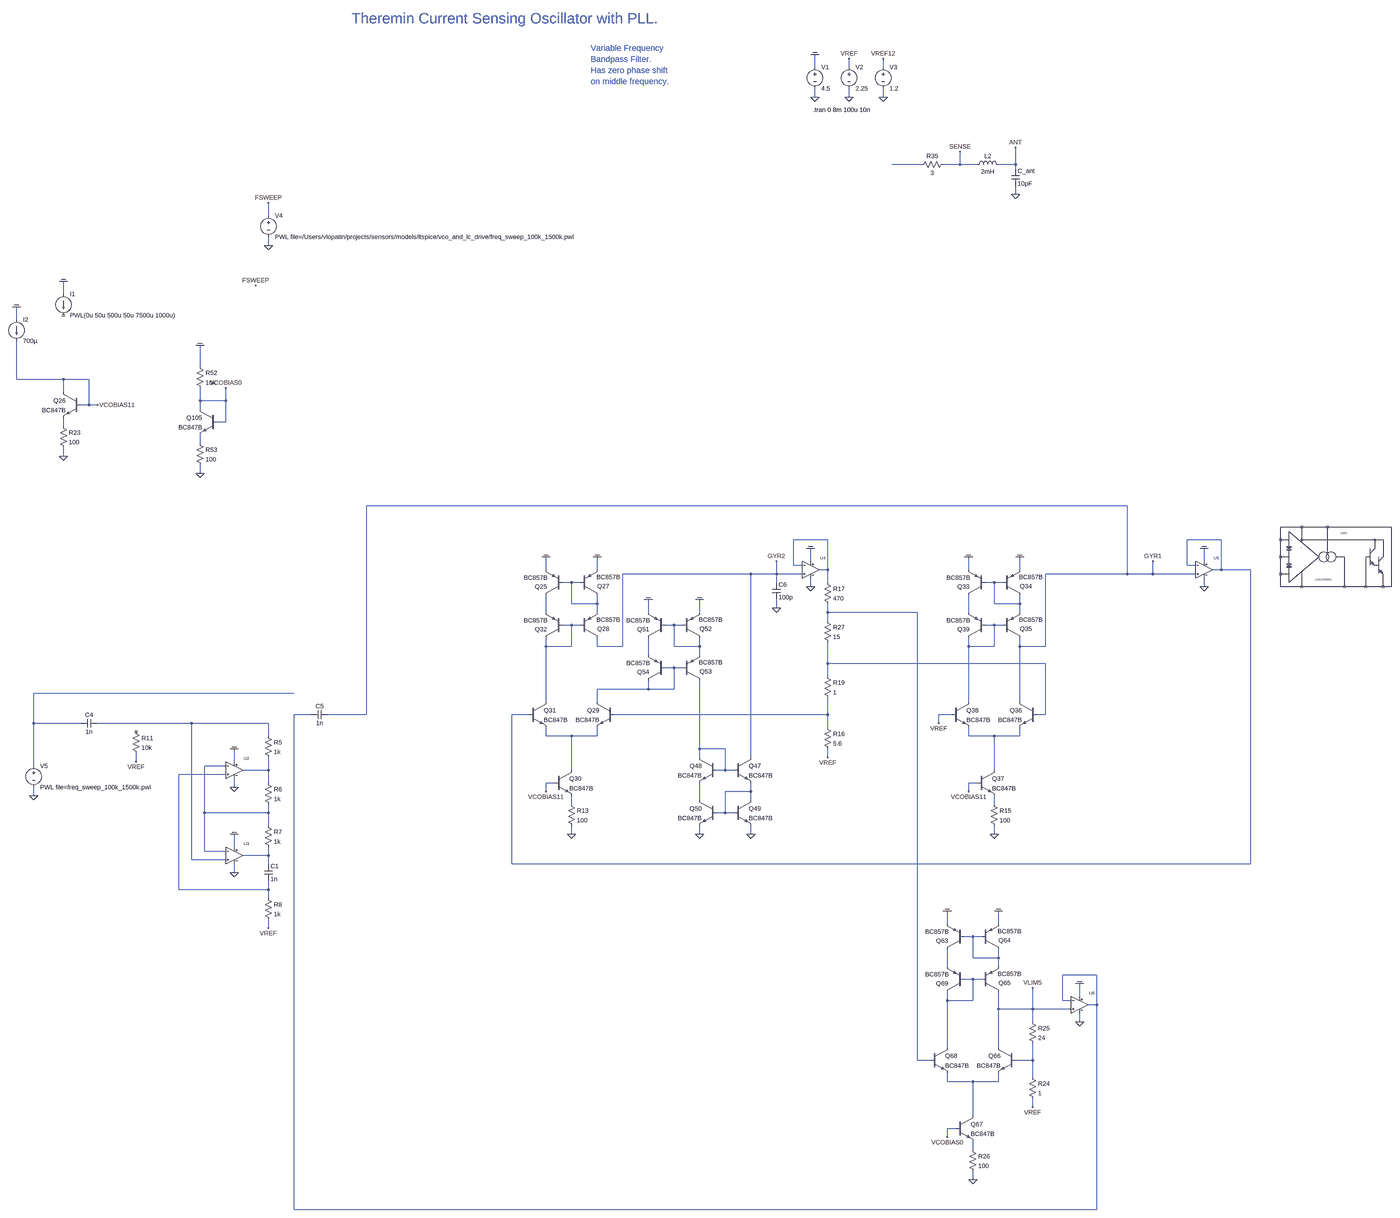
[diagram p0: schematic vco_and_lc_drive_v09_utf8.asc, whole sheet]
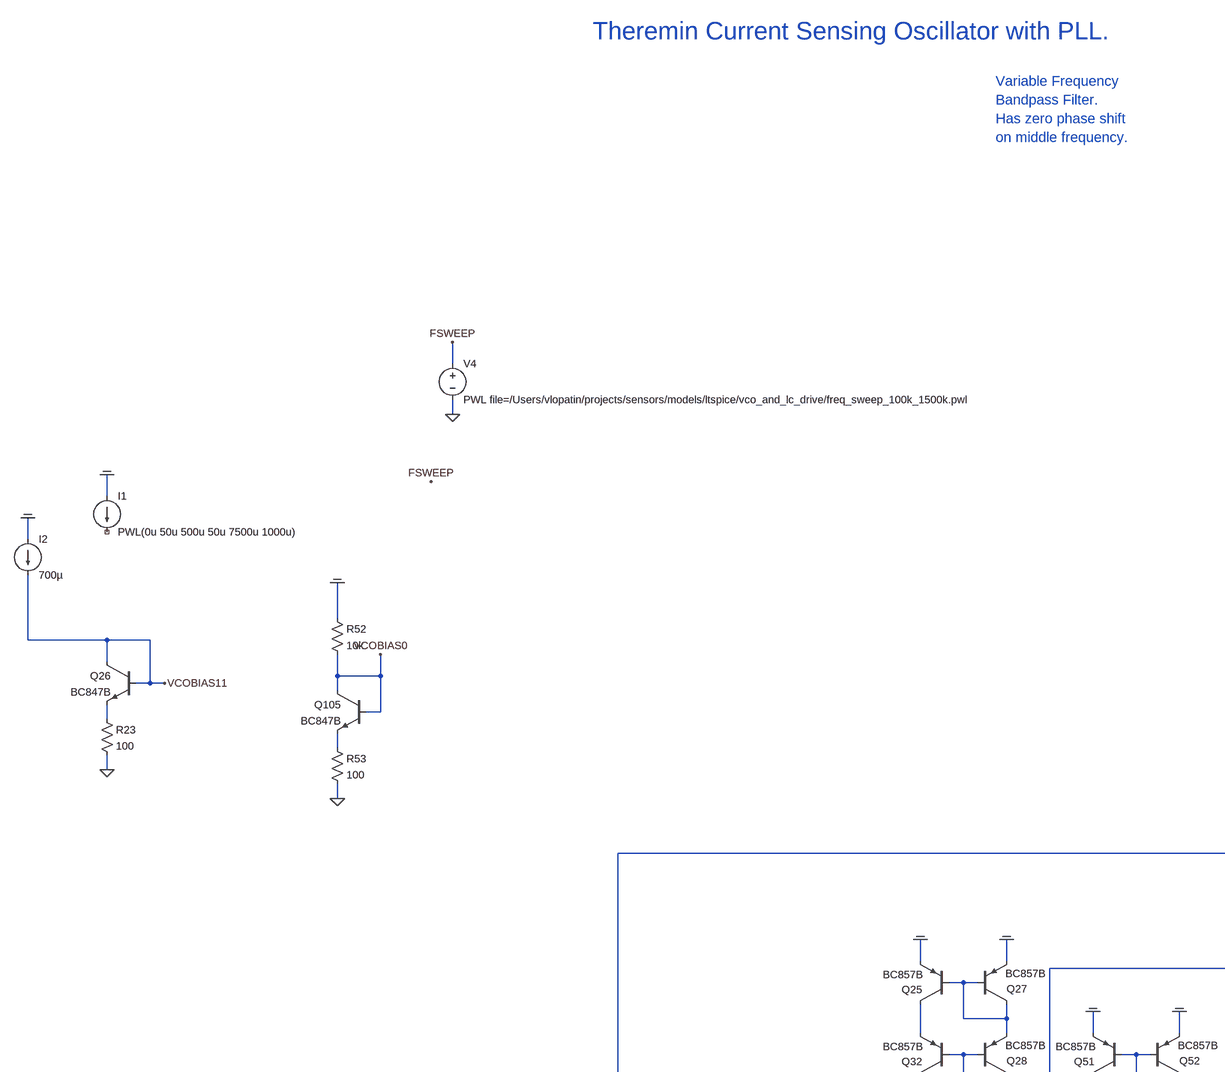
[diagram p1: schematic vco_and_lc_drive_v09_utf8.asc, part, row 1 of 2, column 1 of 2]
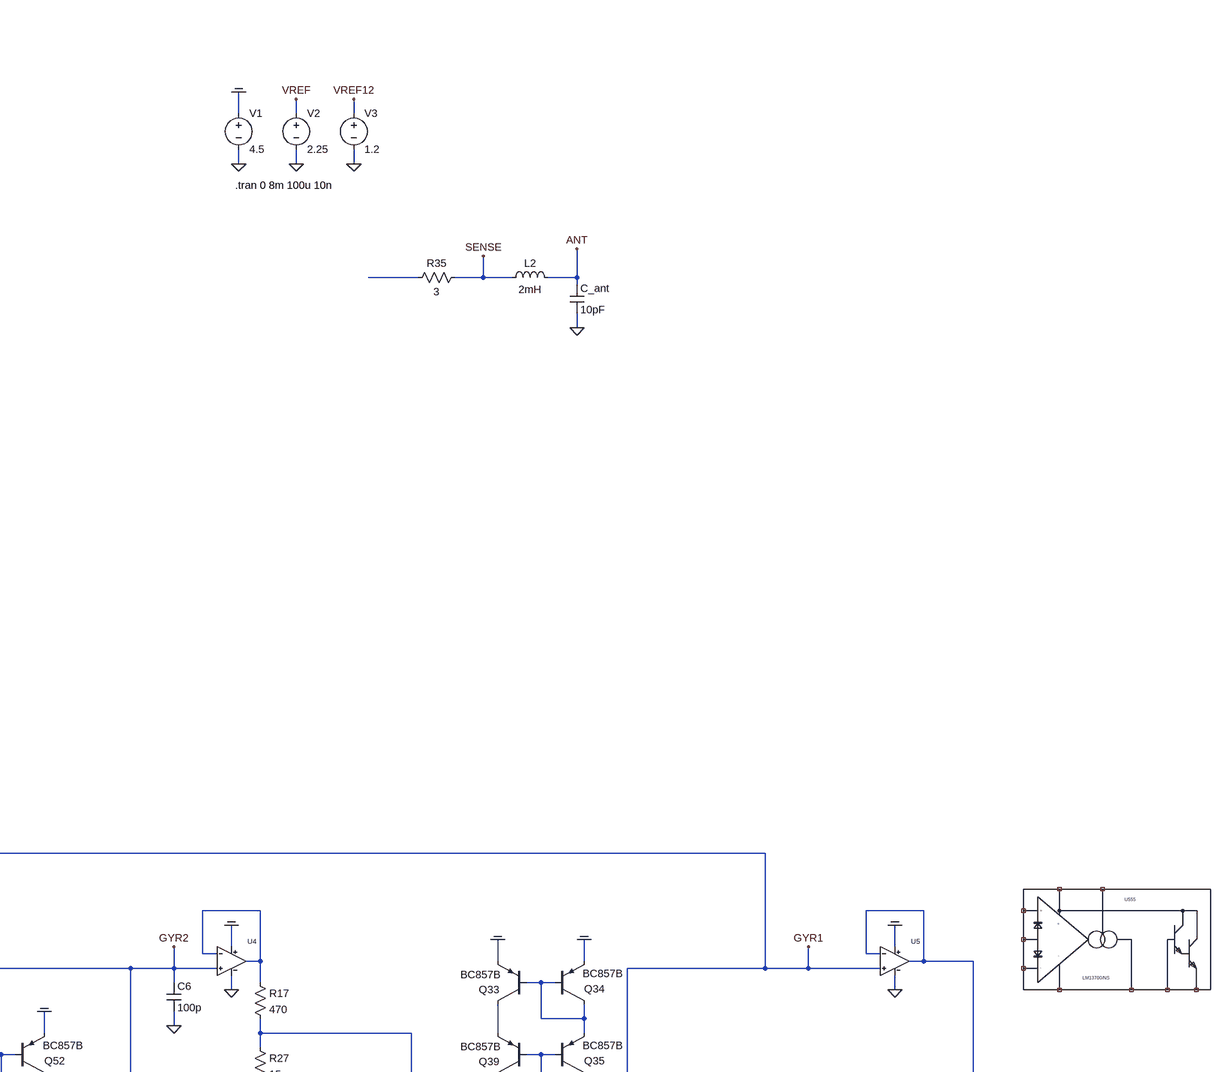
[diagram p2: schematic vco_and_lc_drive_v09_utf8.asc, part, row 1 of 2, column 2 of 2]
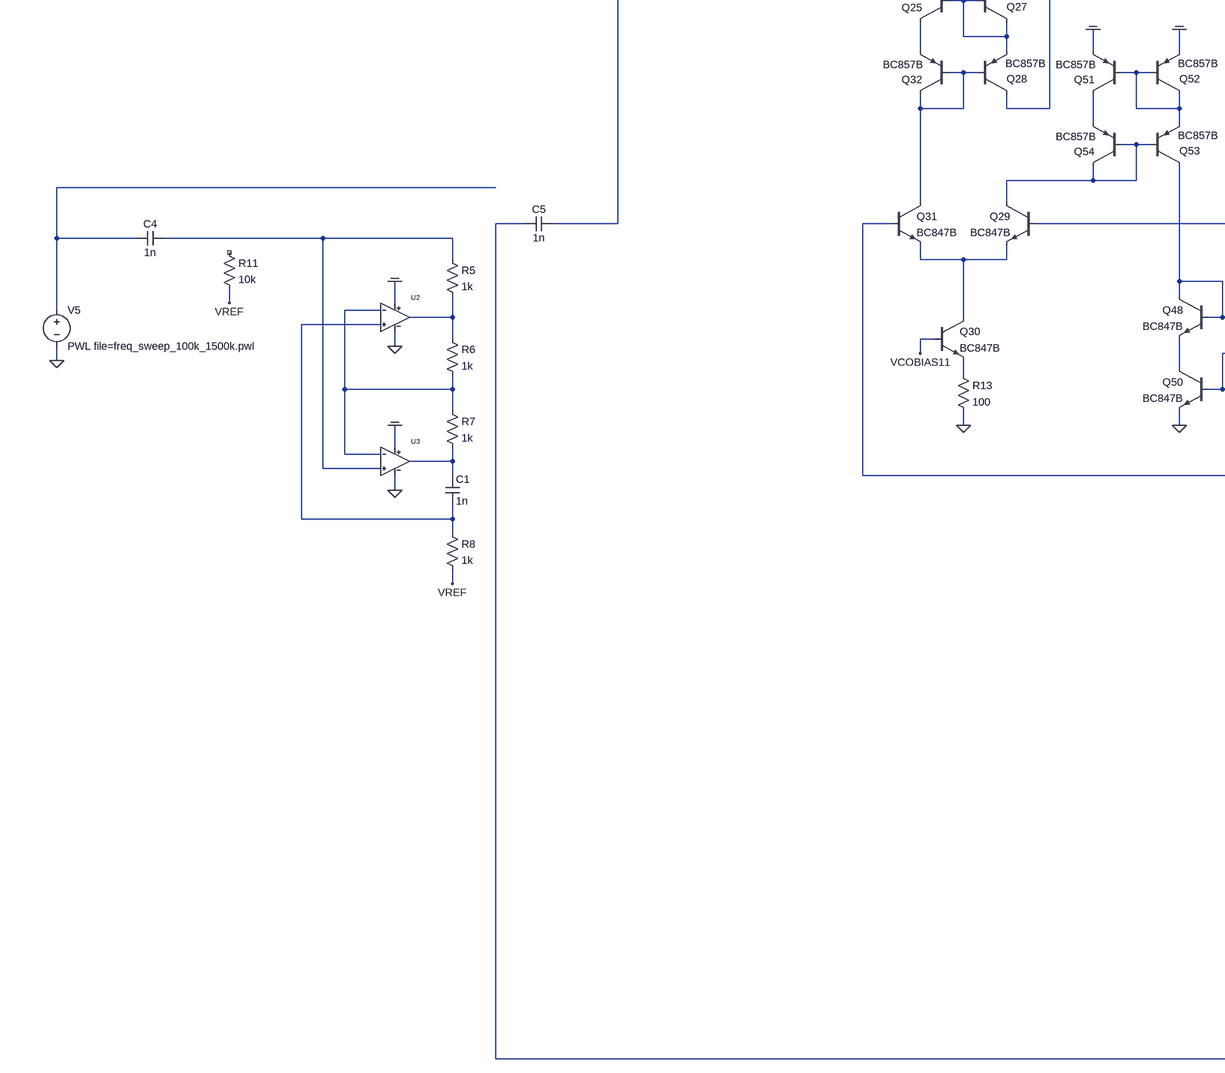
[diagram p3: schematic vco_and_lc_drive_v09_utf8.asc, part, row 2 of 2, column 1 of 2]
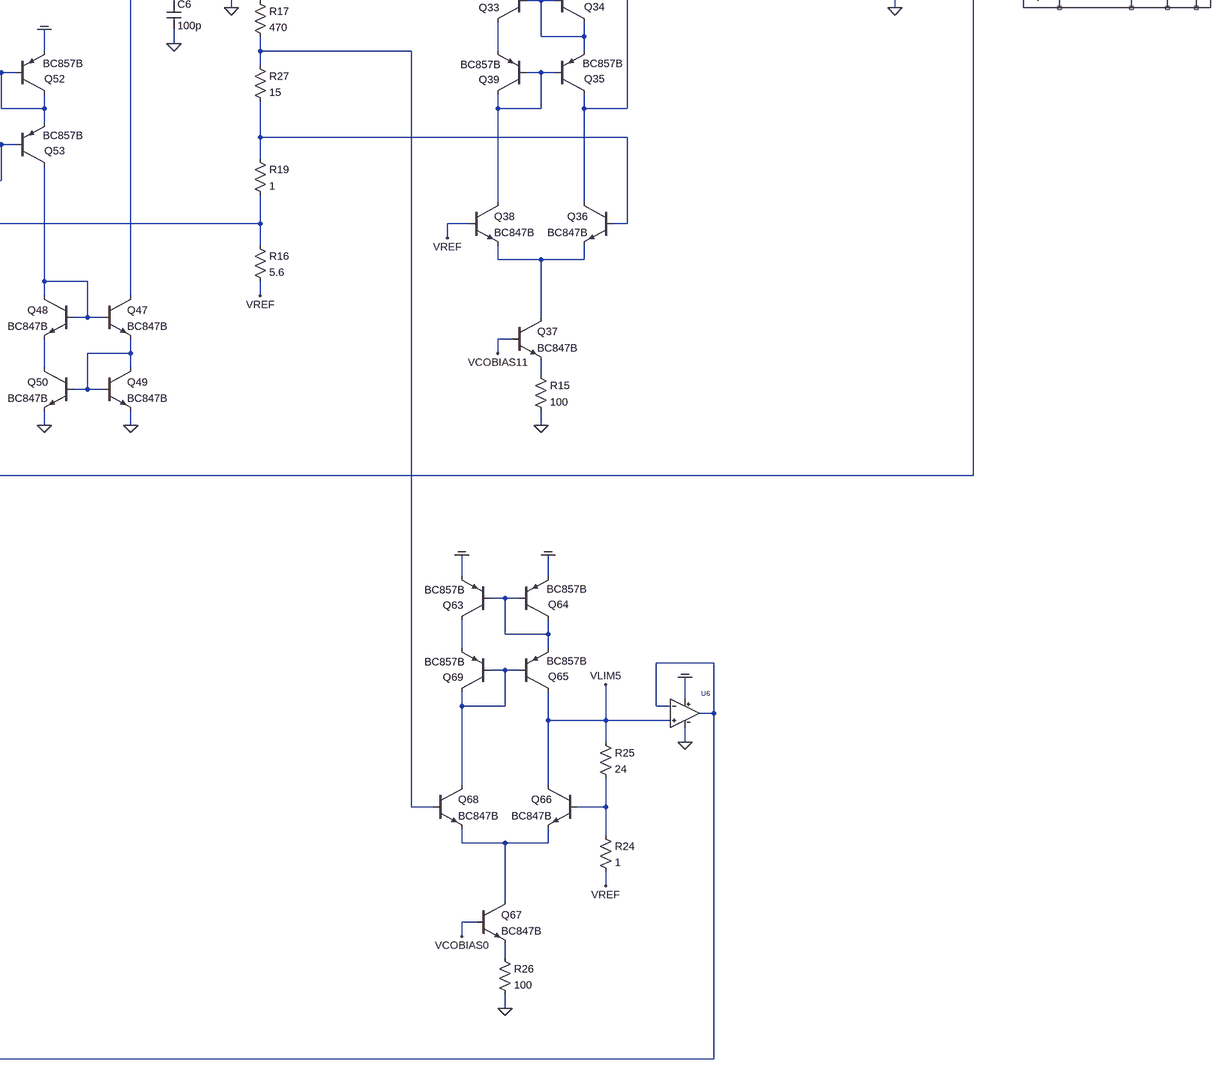
[diagram p4: schematic vco_and_lc_drive_v09_utf8.asc, part, row 2 of 2, column 2 of 2]
vco_and_lc_drive_v09_utf8.asc, the LTspice schematic file:
Version 4
SHEET 1 13504 24832
WIRE -5600 19072 -5600 19024
WIRE -5472 19072 -5472 19040
WIRE -5344 19072 -5344 19040
WIRE -5600 19184 -5600 19152
WIRE -5472 19184 -5472 19152
WIRE -5344 19184 -5344 19152
WIRE -5200 19440 -5312 19440
WIRE -5056 19440 -5056 19392
WIRE -5056 19440 -5120 19440
WIRE -4992 19440 -5056 19440
WIRE -4848 19440 -4848 19376
WIRE -4848 19440 -4912 19440
WIRE -4848 19456 -4848 19440
WIRE -4848 19552 -4848 19520
WIRE -7648 19632 -7648 19584
WIRE -7648 19744 -7648 19712
WIRE -8416 20656 -8416 20608
WIRE -8592 20752 -8592 20704
WIRE -7904 20928 -7904 20848
WIRE -8592 20976 -8592 20832
WIRE -8416 20976 -8592 20976
WIRE -8320 20976 -8416 20976
WIRE -8416 21024 -8416 20976
WIRE -7904 21056 -7904 21008
WIRE -7808 21056 -7808 21008
WIRE -7808 21056 -7904 21056
WIRE -8320 21072 -8320 20976
WIRE -8320 21072 -8352 21072
WIRE -8288 21072 -8320 21072
WIRE -7904 21088 -7904 21056
WIRE -7808 21136 -7808 21056
WIRE -7808 21136 -7840 21136
WIRE -8416 21152 -8416 21120
WIRE -7904 21216 -7904 21184
WIRE -8416 21264 -8416 21232
WIRE -7904 21328 -7904 21296
WIRE -4256 21568 -7280 21568
WIRE -5552 21696 -5680 21696
WIRE -3904 21696 -4032 21696
WIRE -5616 21776 -5616 21728
WIRE -3968 21776 -3968 21728
WIRE -5680 21792 -5680 21696
WIRE -5648 21792 -5680 21792
WIRE -4032 21792 -4032 21696
WIRE -4000 21792 -4032 21792
WIRE -6608 21808 -6608 21760
WIRE -6416 21808 -6416 21760
WIRE -5552 21808 -5552 21696
WIRE -5552 21808 -5584 21808
WIRE -5024 21808 -5024 21760
WIRE -4832 21808 -4832 21760
WIRE -3904 21808 -3904 21696
WIRE -3904 21808 -3936 21808
WIRE -3760 21808 -3904 21808
WIRE -5840 21824 -6320 21824
WIRE -5744 21824 -5744 21776
WIRE -5744 21824 -5840 21824
WIRE -5648 21824 -5744 21824
WIRE -4256 21824 -4256 21568
WIRE -4256 21824 -4736 21824
WIRE -4160 21824 -4160 21776
WIRE -4160 21824 -4256 21824
WIRE -4000 21824 -4160 21824
WIRE -6512 21856 -6544 21856
WIRE -6480 21856 -6512 21856
WIRE -5744 21856 -5744 21824
WIRE -5552 21856 -5552 21808
WIRE -4928 21856 -4960 21856
WIRE -4896 21856 -4928 21856
WIRE -5616 21872 -5616 21840
WIRE -3968 21872 -3968 21840
WIRE -6512 21936 -6512 21856
WIRE -6416 21936 -6416 21904
WIRE -6416 21936 -6512 21936
WIRE -4928 21936 -4928 21856
WIRE -4832 21936 -4832 21904
WIRE -4832 21936 -4928 21936
WIRE -5744 21952 -5744 21920
WIRE -6608 21968 -6608 21904
WIRE -6416 21968 -6416 21936
WIRE -6224 21968 -6224 21920
WIRE -6032 21968 -6032 21920
WIRE -5552 21968 -5552 21936
WIRE -5216 21968 -5552 21968
WIRE -5024 21968 -5024 21904
WIRE -4832 21968 -4832 21936
WIRE -5552 22000 -5552 21968
WIRE -6512 22016 -6544 22016
WIRE -6480 22016 -6512 22016
WIRE -6128 22016 -6160 22016
WIRE -6096 22016 -6128 22016
WIRE -4928 22016 -4960 22016
WIRE -4896 22016 -4928 22016
WIRE -6608 22096 -6608 22064
WIRE -6512 22096 -6512 22016
WIRE -6512 22096 -6608 22096
WIRE -6416 22096 -6416 22064
WIRE -6320 22096 -6320 21824
WIRE -6320 22096 -6416 22096
WIRE -6128 22096 -6128 22016
WIRE -6032 22096 -6032 22064
WIRE -6032 22096 -6128 22096
WIRE -5024 22096 -5024 22064
WIRE -4928 22096 -4928 22016
WIRE -4928 22096 -5024 22096
WIRE -4832 22096 -4832 22064
WIRE -4736 22096 -4736 21824
WIRE -4736 22096 -4832 22096
WIRE -6224 22128 -6224 22064
WIRE -6032 22128 -6032 22096
WIRE -5552 22160 -5552 22080
WIRE -4736 22160 -5552 22160
WIRE -6128 22176 -6160 22176
WIRE -6096 22176 -6128 22176
WIRE -5552 22208 -5552 22160
WIRE -6224 22256 -6224 22224
WIRE -6224 22256 -6416 22256
WIRE -6128 22256 -6128 22176
WIRE -6128 22256 -6224 22256
WIRE -7552 22272 -8528 22272
WIRE -6608 22304 -6608 22096
WIRE -6416 22304 -6416 22256
WIRE -5024 22304 -5024 22096
WIRE -4832 22304 -4832 22096
WIRE -7488 22352 -7552 22352
WIRE -7280 22352 -7280 21568
WIRE -7280 22352 -7424 22352
WIRE -6672 22352 -6736 22352
WIRE -5552 22352 -5552 22288
WIRE -5552 22352 -6352 22352
WIRE -5088 22352 -5136 22352
WIRE -4736 22352 -4736 22160
WIRE -4736 22352 -4768 22352
WIRE -8528 22384 -8528 22272
WIRE -8352 22384 -8528 22384
WIRE -7936 22384 -8288 22384
WIRE -7648 22384 -7936 22384
WIRE -5136 22384 -5136 22352
WIRE -5552 22400 -5552 22352
WIRE -7648 22432 -7648 22384
WIRE -6608 22432 -6608 22400
WIRE -6512 22432 -6608 22432
WIRE -6416 22432 -6416 22400
WIRE -6416 22432 -6512 22432
WIRE -5024 22432 -5024 22400
WIRE -4928 22432 -5024 22432
WIRE -4832 22432 -4832 22400
WIRE -4832 22432 -4928 22432
WIRE -6032 22480 -6032 22224
WIRE -5936 22480 -6032 22480
WIRE -6032 22512 -6032 22480
WIRE -5840 22512 -5840 21824
WIRE -5552 22512 -5552 22480
WIRE -8144 22528 -8144 22496
WIRE -7776 22528 -7776 22480
WIRE -8528 22544 -8528 22384
WIRE -7808 22544 -7888 22544
WIRE -7648 22560 -7648 22512
WIRE -7648 22560 -7744 22560
WIRE -6512 22560 -6512 22432
WIRE -5936 22560 -5936 22480
WIRE -5936 22560 -5968 22560
WIRE -5904 22560 -5936 22560
WIRE -4928 22560 -4928 22432
WIRE -7808 22576 -7984 22576
WIRE -7648 22608 -7648 22560
WIRE -6576 22608 -6608 22608
WIRE -4992 22608 -5024 22608
WIRE -7776 22624 -7776 22592
WIRE -6608 22640 -6608 22608
WIRE -5840 22640 -5840 22608
WIRE -5840 22640 -5936 22640
WIRE -5024 22640 -5024 22608
WIRE -8528 22656 -8528 22624
WIRE -6032 22672 -6032 22608
WIRE -5840 22672 -5840 22640
WIRE -6512 22688 -6512 22656
WIRE -4928 22688 -4928 22656
WIRE -7888 22720 -7888 22544
WIRE -7648 22720 -7648 22688
WIRE -7648 22720 -7888 22720
WIRE -5936 22720 -5936 22640
WIRE -5936 22720 -5968 22720
WIRE -5904 22720 -5936 22720
WIRE -7648 22768 -7648 22720
WIRE -6512 22800 -6512 22768
WIRE -6032 22800 -6032 22768
WIRE -5840 22800 -5840 22768
WIRE -4928 22800 -4928 22768
WIRE -7776 22848 -7776 22800
WIRE -7888 22864 -7888 22720
WIRE -7808 22864 -7888 22864
WIRE -7648 22880 -7648 22848
WIRE -7648 22880 -7744 22880
WIRE -7936 22896 -7936 22384
WIRE -7808 22896 -7936 22896
WIRE -7648 22912 -7648 22880
WIRE -6736 22912 -6736 22352
WIRE -3760 22912 -3760 21808
WIRE -3760 22912 -6736 22912
WIRE -7776 22944 -7776 22912
WIRE -7984 23008 -7984 22576
WIRE -7648 23008 -7648 22976
WIRE -7648 23008 -7984 23008
WIRE -7648 23040 -7648 23008
WIRE -5104 23136 -5104 23088
WIRE -4912 23136 -4912 23088
WIRE -7648 23152 -7648 23120
WIRE -5008 23184 -5040 23184
WIRE -4976 23184 -5008 23184
WIRE -5008 23264 -5008 23184
WIRE -4912 23264 -4912 23232
WIRE -4912 23264 -5008 23264
WIRE -5104 23296 -5104 23232
WIRE -4912 23296 -4912 23264
WIRE -4544 23328 -4672 23328
WIRE -5008 23344 -5040 23344
WIRE -4976 23344 -5008 23344
WIRE -4608 23408 -4608 23360
WIRE -5104 23424 -5104 23392
WIRE -5008 23424 -5008 23344
WIRE -5008 23424 -5104 23424
WIRE -4672 23424 -4672 23328
WIRE -4640 23424 -4672 23424
WIRE -4544 23440 -4544 23328
WIRE -4544 23440 -4576 23440
WIRE -4912 23456 -4912 23392
WIRE -4784 23456 -4784 23376
WIRE -4784 23456 -4912 23456
WIRE -4640 23456 -4784 23456
WIRE -4784 23504 -4784 23456
WIRE -4608 23504 -4608 23472
WIRE -5104 23600 -5104 23424
WIRE -4912 23600 -4912 23456
WIRE -5216 23648 -5216 21968
WIRE -5168 23648 -5216 23648
WIRE -4784 23648 -4784 23584
WIRE -4784 23648 -4848 23648
WIRE -4784 23712 -4784 23648
WIRE -5104 23728 -5104 23696
WIRE -5008 23728 -5104 23728
WIRE -4912 23728 -4912 23696
WIRE -4912 23728 -5008 23728
WIRE -4784 23824 -4784 23792
WIRE -5008 23856 -5008 23728
WIRE -5072 23904 -5104 23904
WIRE -5104 23936 -5104 23904
WIRE -5008 23984 -5008 23952
WIRE -5008 24096 -5008 24064
WIRE -7552 24208 -7552 22352
WIRE -4544 24208 -4544 23440
WIRE -4544 24208 -7552 24208
FLAG -5600 19184 0
FLAG -5600 19024 COM
FLAG -5472 19184 0
FLAG -5472 19040 VREF
FLAG -4848 19552 0
FLAG -4848 19376 ANT
FLAG -5056 19392 SENSE
FLAG -5344 19184 0
FLAG -5344 19040 VREF12
FLAG -8416 20608 COM
FLAG -8288 21072 VCOBIAS11
FLAG -8416 21264 0
FLAG -7904 20848 COM
FLAG -7904 21328 0
FLAG -7808 21008 VCOBIAS0
FLAG -7648 19744 0
FLAG -7648 19584 FSWEEP
FLAG -8592 20704 COM
FLAG -7696 20624 FSWEEP
FLAG -7776 22624 0
FLAG -7776 22480 COM
FLAG -7776 22944 0
FLAG -7776 22800 COM
FLAG -8528 22656 0
FLAG -7648 23152 VREF
FLAG -8144 22528 VREF
FLAG -6608 21760 COM
FLAG -6416 21760 COM
FLAG -6608 22640 VCOBIAS11
FLAG -6512 22800 0
FLAG -5744 21776 GYR2
FLAG -5744 21952 0
FLAG -4160 21776 GYR1
FLAG -5616 21872 0
FLAG -5616 21728 COM
FLAG -5552 22512 VREF
FLAG -6032 22800 0
FLAG -5840 22800 0
FLAG -6224 21920 COM
FLAG -6032 21920 COM
FLAG -5024 21760 COM
FLAG -4832 21760 COM
FLAG -5024 22640 VCOBIAS11
FLAG -4928 22800 0
FLAG -3968 21872 0
FLAG -3968 21728 COM
FLAG -5136 22384 VREF
FLAG -5104 23088 COM
FLAG -4912 23088 COM
FLAG -4784 23824 VREF
FLAG -4784 23376 VLIM5
FLAG -5104 23936 VCOBIAS0
FLAG -5008 24096 0
FLAG -4608 23504 0
FLAG -4608 23360 COM
SYMBOL voltage -5600 19056 R0
SYMATTR InstName V1
SYMATTR Value 4.5
SYMBOL Voltage -5472 19056 R0
SYMATTR InstName V2
SYMATTR Value 2.25
SYMBOL ind -5008 19456 R270
WINDOW 0 32 56 VTop 2
WINDOW 3 5 56 VBottom 2
SYMATTR InstName L2
SYMATTR Value 2mH
SYMATTR SpiceLine Rser=120 Cpar=1pF
SYMBOL Cap -4864 19456 R0
SYMATTR InstName C_ant
SYMATTR Value 10pF
SYMBOL Res -5216 19456 R270
WINDOW 0 32 56 VTop 2
WINDOW 3 0 56 VBottom 2
SYMATTR InstName R35
SYMATTR Value 3
SYMBOL Voltage -5344 19056 R0
SYMATTR InstName V3
SYMATTR Value 1.2
SYMBOL npn -8352 21024 M0
SYMATTR InstName Q26
SYMATTR Value BC847B
SYMBOL Res -8432 21136 R0
SYMATTR InstName R23
SYMATTR Value 100
SYMBOL current -8416 20656 R0
SYMATTR InstName I1
SYMATTR Value PWL(0u 50u 500u 50u 7500u 1000u)
SYMBOL npn -7840 21088 M0
SYMATTR InstName Q105
SYMATTR Value BC847B
SYMBOL Res -7920 20912 R0
SYMATTR InstName R52
SYMATTR Value 10k
SYMBOL Res -7920 21200 R0
SYMATTR InstName R53
SYMATTR Value 100
SYMBOL Voltage -7648 19616 R0
SYMATTR InstName V4
SYMATTR Value PWL file=/Users/vlopatin/projects/sensors/models/ltspice/vco_and_lc_drive/freq_sweep_100k_1500k.pwl
SYMBOL current -8592 20752 R0
SYMATTR InstName I2
SYMATTR Value 700µ
SYMBOL MCP6021 -7776 22560 R0
SYMATTR InstName U2
SYMBOL Res -7664 22416 R0
SYMATTR InstName R5
SYMATTR Value 1k
SYMBOL Res -7664 22592 R0
SYMATTR InstName R6
SYMATTR Value 1k
SYMBOL Res -7664 22752 R0
SYMATTR InstName R7
SYMATTR Value 1k
SYMBOL Res -7664 23024 R0
SYMATTR InstName R8
SYMATTR Value 1k
SYMBOL Cap -7664 22912 R0
SYMATTR InstName C1
SYMATTR Value 1n
SYMBOL MCP6021 -7776 22880 R0
SYMATTR InstName U3
SYMBOL Cap -8288 22368 R90
WINDOW 0 0 32 VBottom 2
WINDOW 3 32 32 VTop 2
SYMATTR InstName C4
SYMATTR Value 1n
SYMBOL Voltage -8528 22528 R0
SYMATTR InstName V5
SYMATTR Value PWL file=freq_sweep_100k_1500k.pwl
SYMBOL Res -8160 22400 R0
SYMATTR InstName R11
SYMATTR Value 10k
SYMBOL pnp -6544 21904 R180
WINDOW 0 60 32 Left 2
WINDOW 3 58 66 Left 2
SYMATTR InstName Q25
SYMATTR Value BC857B
SYMBOL pnp -6480 21904 M180
WINDOW 0 64 34 Left 2
WINDOW 3 61 68 Left 2
SYMATTR InstName Q27
SYMATTR Value BC857B
SYMBOL pnp -6480 22064 M180
WINDOW 0 64 34 Left 2
WINDOW 3 61 68 Left 2
SYMATTR InstName Q28
SYMATTR Value BC857B
SYMBOL npn -6352 22304 M0
SYMATTR InstName Q29
SYMATTR Value BC847B
SYMBOL npn -6576 22560 R0
SYMATTR InstName Q30
SYMATTR Value BC847B
SYMBOL npn -6672 22304 R0
SYMATTR InstName Q31
SYMATTR Value BC847B
SYMBOL Res -6528 22672 R0
SYMATTR InstName R13
SYMATTR Value 100
SYMBOL pnp -6544 22064 R180
WINDOW 0 60 32 Left 2
WINDOW 3 58 66 Left 2
SYMATTR InstName Q32
SYMATTR Value BC857B
SYMBOL Cap -5760 21856 R0
SYMATTR InstName C6
SYMATTR Value 100p
SYMBOL Cap -7424 22336 R90
WINDOW 0 0 32 VBottom 2
WINDOW 3 32 32 VTop 2
SYMATTR InstName C5
SYMATTR Value 1n
SYMBOL MCP6021 -5616 21808 R0
SYMATTR InstName U4
SYMBOL Res -5568 22384 R0
SYMATTR InstName R16
SYMATTR Value 5.6
SYMBOL Res -5568 21840 R0
SYMATTR InstName R17
SYMATTR Value 470
SYMBOL npn -5904 22512 R0
SYMATTR InstName Q47
SYMATTR Value BC847B
SYMBOL npn -5968 22512 M0
SYMATTR InstName Q48
SYMATTR Value BC847B
SYMBOL npn -5904 22672 R0
SYMATTR InstName Q49
SYMATTR Value BC847B
SYMBOL npn -5968 22672 M0
SYMATTR InstName Q50
SYMATTR Value BC847B
SYMBOL pnp -6160 22064 R180
WINDOW 0 60 32 Left 2
WINDOW 3 58 66 Left 2
SYMATTR InstName Q51
SYMATTR Value BC857B
SYMBOL pnp -6096 22064 M180
WINDOW 0 64 34 Left 2
WINDOW 3 61 68 Left 2
SYMATTR InstName Q52
SYMATTR Value BC857B
SYMBOL pnp -6096 22224 M180
WINDOW 0 64 34 Left 2
WINDOW 3 61 68 Left 2
SYMATTR InstName Q53
SYMATTR Value BC857B
SYMBOL pnp -6160 22224 R180
WINDOW 0 60 32 Left 2
WINDOW 3 58 66 Left 2
SYMATTR InstName Q54
SYMATTR Value BC857B
SYMBOL Res -5568 22192 R0
SYMATTR InstName R19
SYMATTR Value 1
SYMBOL pnp -4960 21904 R180
WINDOW 0 60 32 Left 2
WINDOW 3 58 66 Left 2
SYMATTR InstName Q33
SYMATTR Value BC857B
SYMBOL pnp -4896 21904 M180
WINDOW 0 64 34 Left 2
WINDOW 3 61 68 Left 2
SYMATTR InstName Q34
SYMATTR Value BC857B
SYMBOL pnp -4896 22064 M180
WINDOW 0 64 34 Left 2
WINDOW 3 61 68 Left 2
SYMATTR InstName Q35
SYMATTR Value BC857B
SYMBOL npn -4768 22304 M0
SYMATTR InstName Q36
SYMATTR Value BC847B
SYMBOL npn -4992 22560 R0
SYMATTR InstName Q37
SYMATTR Value BC847B
SYMBOL npn -5088 22304 R0
SYMATTR InstName Q38
SYMATTR Value BC847B
SYMBOL Res -4944 22672 R0
SYMATTR InstName R15
SYMATTR Value 100
SYMBOL pnp -4960 22064 R180
WINDOW 0 60 32 Left 2
WINDOW 3 58 66 Left 2
SYMATTR InstName Q39
SYMATTR Value BC857B
SYMBOL MCP6021 -3968 21808 R0
SYMATTR InstName U5
SYMBOL pnp -5040 23232 R180
WINDOW 0 60 32 Left 2
WINDOW 3 58 66 Left 2
SYMATTR InstName Q63
SYMATTR Value BC857B
SYMBOL pnp -4976 23232 M180
WINDOW 0 64 34 Left 2
WINDOW 3 61 68 Left 2
SYMATTR InstName Q64
SYMATTR Value BC857B
SYMBOL pnp -4976 23392 M180
WINDOW 0 64 34 Left 2
WINDOW 3 61 68 Left 2
SYMATTR InstName Q65
SYMATTR Value BC857B
SYMBOL Res -4800 23696 R0
SYMATTR InstName R24
SYMATTR Value 1
SYMBOL Res -4800 23488 R0
SYMATTR InstName R25
SYMATTR Value 24
SYMBOL npn -4848 23600 M0
SYMATTR InstName Q66
SYMATTR Value BC847B
SYMBOL npn -5072 23856 R0
SYMATTR InstName Q67
SYMATTR Value BC847B
SYMBOL npn -5168 23600 R0
SYMATTR InstName Q68
SYMATTR Value BC847B
SYMBOL Res -5024 23968 R0
SYMATTR InstName R26
SYMATTR Value 100
SYMBOL pnp -5040 23392 R180
WINDOW 0 60 32 Left 2
WINDOW 3 58 66 Left 2
SYMATTR InstName Q69
SYMATTR Value BC857B
SYMBOL MCP6021 -4608 23440 R0
SYMATTR InstName U6
SYMBOL Res -5568 21984 R0
SYMATTR InstName R27
SYMATTR Value 15
SYMBOL LM13700 -3552 21760 R0
SYMATTR InstName U555
TEXT -5608 19232 Left 2 !.tran 0 8m 100u 10n
TEXT -7336 18888 Left 5 ;Theremin Current Sensing Oscillator with PLL.
TEXT -6440 19000 Left 3 ;Variable Frequency \nBandpass Filter.\nHas zero phase shift \non middle frequency.

The netlist it stands for:
* vco_and_lc_drive_v09_utf8.asc
V1 COM 0 4.5
V2 VREF 0 2.25
L2 SENSE ANT 2mH Rser=120 Cpar=1pF
C_ant ANT 0 10pF
R35 N001 SENSE 3
V3 VREF12 0 1.2
Q26 VCOBIAS11 VCOBIAS11 N002 0 BC847B
R23 N002 0 100
I1 COM NC_01 PWL(0u 50u 500u 50u 7500u 1000u)
Q105 VCOBIAS0 VCOBIAS0 N003 0 BC847B
R52 COM VCOBIAS0 10k
R53 N003 0 100
V4 FSWEEP 0 PWL file=/Users/vlopatin/projects/sensors/models/ltspice/vco_and_lc_drive/freq_sweep_100k_1500k.pwl
I2 COM VCOBIAS11 700µ
XU2 N026 N024 COM 0 N025 MCP6021  ; pins In+ In- V+ V- OUT
R5 N020 N025 1k
R6 N025 N024 1k
R7 N024 N031 1k
R8 N026 VREF 1k
C1 N031 N026 1n
XU3 N020 N024 COM 0 N031 MCP6021  ; pins In+ In- V+ V- OUT
C4 N020 N017 1n
V5 N017 0 PWL file=freq_sweep_100k_1500k.pwl
R11 NC_02 VREF 10k
Q25 N008 N006 COM 0 BC857B
Q27 N006 N006 COM 0 BC857B
Q28 GYR2 N011 N006 0 BC857B
Q29 N016 N019 N021 0 BC847B
Q30 N021 VCOBIAS11 N029 0 BC847B
Q31 N011 N005 N021 0 BC847B
R13 N029 0 100
Q32 N011 N011 N008 0 BC857B
C6 GYR2 0 100p
C5 GYR1 N018 1n
XU4 GYR2 N004 COM 0 N004 MCP6021  ; pins In+ In- V+ V- OUT
R16 N019 VREF 5.6
R17 N004 N009 470
Q47 GYR2 N023 N027 0 BC847B
Q48 N023 N023 N028 0 BC847B
Q49 N027 N027 0 0 BC847B
Q50 N028 N027 0 0 BC847B
Q51 N014 N012 COM 0 BC857B
Q52 N012 N012 COM 0 BC857B
Q53 N023 N016 N012 0 BC857B
Q54 N016 N016 N014 0 BC857B
R19 N015 N019 1
Q33 N010 N007 COM 0 BC857B
Q34 N007 N007 COM 0 BC857B
Q35 GYR1 N013 N007 0 BC857B
Q36 GYR1 N015 N022 0 BC847B
Q37 N022 VCOBIAS11 N030 0 BC847B
Q38 N013 VREF N022 0 BC847B
R15 N030 0 100
Q39 N013 N013 N010 0 BC857B
XU5 GYR1 N005 COM 0 N005 MCP6021  ; pins In+ In- V+ V- OUT
Q63 N033 N032 COM 0 BC857B
Q64 N032 N032 COM 0 BC857B
Q65 VLIM5 N034 N032 0 BC857B
R24 N035 VREF 1
R25 VLIM5 N035 24
Q66 VLIM5 N035 N036 0 BC847B
Q67 N036 VCOBIAS0 N037 0 BC847B
Q68 N034 N009 N036 0 BC847B
R26 N037 0 100
Q69 N034 N034 N033 0 BC857B
XU6 VLIM5 N018 COM 0 N018 MCP6021  ; pins In+ In- V+ V- OUT
R27 N009 N015 15
XU555 NC_03 NC_04 NC_05 NC_06 NC_07 NC_08 NC_09 NC_10 NC_11 LM13700/NS  ; pins Ibias Dio_bias in+ in- out V- buf_in buf_out V+
.model NPN NPN
.model PNP PNP
.lib standard.bjt
.tran 0 8m 100u 10n
* Theremin Current Sensing Oscillator with PLL.
* Variable Frequency
* Bandpass Filter.
* Has zero phase shift
* on middle frequency.
.lib MCP6021.cir
.lib ns_models.lib
.backanno
.end